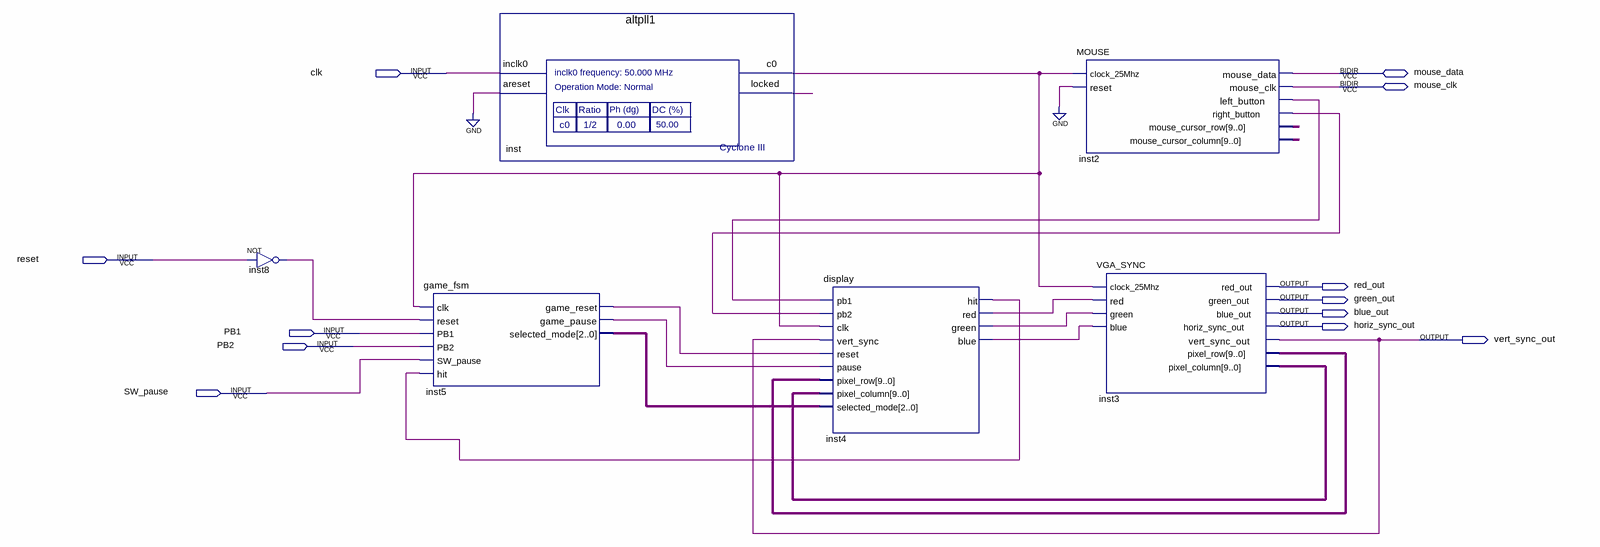
[diagram p0: schematic sheet]
// Quartus schematic vgaTest.bdf as structural Verilog: 6 symbols, 12 pins
module vgaTest (
  input  clk,
  input  reset,
  input  PB1,
  input  PB2,
  input  SW_pause,
  inout  mouse_data,
  inout  mouse_clk,
  output red_out,
  output green_out,
  output blue_out,
  output horiz_sync_out,
  output vert_sync_out
);

  wire inst2_left_button, inst2_right_button, inst4_blue, inst4_green, inst4_hit, inst4_red,
       inst5_game_pause, inst5_game_reset, inst8_out, inst_c0, inst_locked;
  wire [2:0] inst5_selected_mode;
  wire [9:0] inst2_mouse_cursor_column, inst2_mouse_cursor_row, inst3_pixel_column, inst3_pixel_row;

  not inst8 (inst8_out, reset);
  game_fsm inst5 (
    .clk(inst_c0), .reset(inst8_out), .PB1(PB1), .PB2(PB2), .SW_pause(SW_pause), .hit(inst4_hit),
    .game_reset(inst5_game_reset), .game_pause(inst5_game_pause), .selected_mode(inst5_selected_mode));
  altpll1 inst (.inclk0(clk), .areset(1'b0), .c0(inst_c0), .locked(inst_locked));
  display inst4 (
    .pb1(inst2_left_button), .pb2(inst2_right_button), .clk(inst_c0), .vert_sync(vert_sync_out),
    .reset(inst5_game_reset), .pause(inst5_game_pause), .pixel_row(inst3_pixel_row),
    .pixel_column(inst3_pixel_column), .selected_mode(inst5_selected_mode), .hit(inst4_hit), .red(inst4_red),
    .green(inst4_green), .blue(inst4_blue));
  MOUSE inst2 (
    .clock_25Mhz(inst_c0), .reset(1'b0), .left_button(inst2_left_button), .right_button(inst2_right_button),
    .mouse_cursor_row(inst2_mouse_cursor_row), .mouse_cursor_column(inst2_mouse_cursor_column),
    .mouse_data(mouse_data), .mouse_clk(mouse_clk));
  VGA_SYNC inst3 (
    .clock_25Mhz(inst_c0), .red(inst4_red), .green(inst4_green), .blue(inst4_blue), .red_out(red_out),
    .green_out(green_out), .blue_out(blue_out), .horiz_sync_out(horiz_sync_out),
    .vert_sync_out(vert_sync_out), .pixel_row(inst3_pixel_row), .pixel_column(inst3_pixel_column));
endmodule
